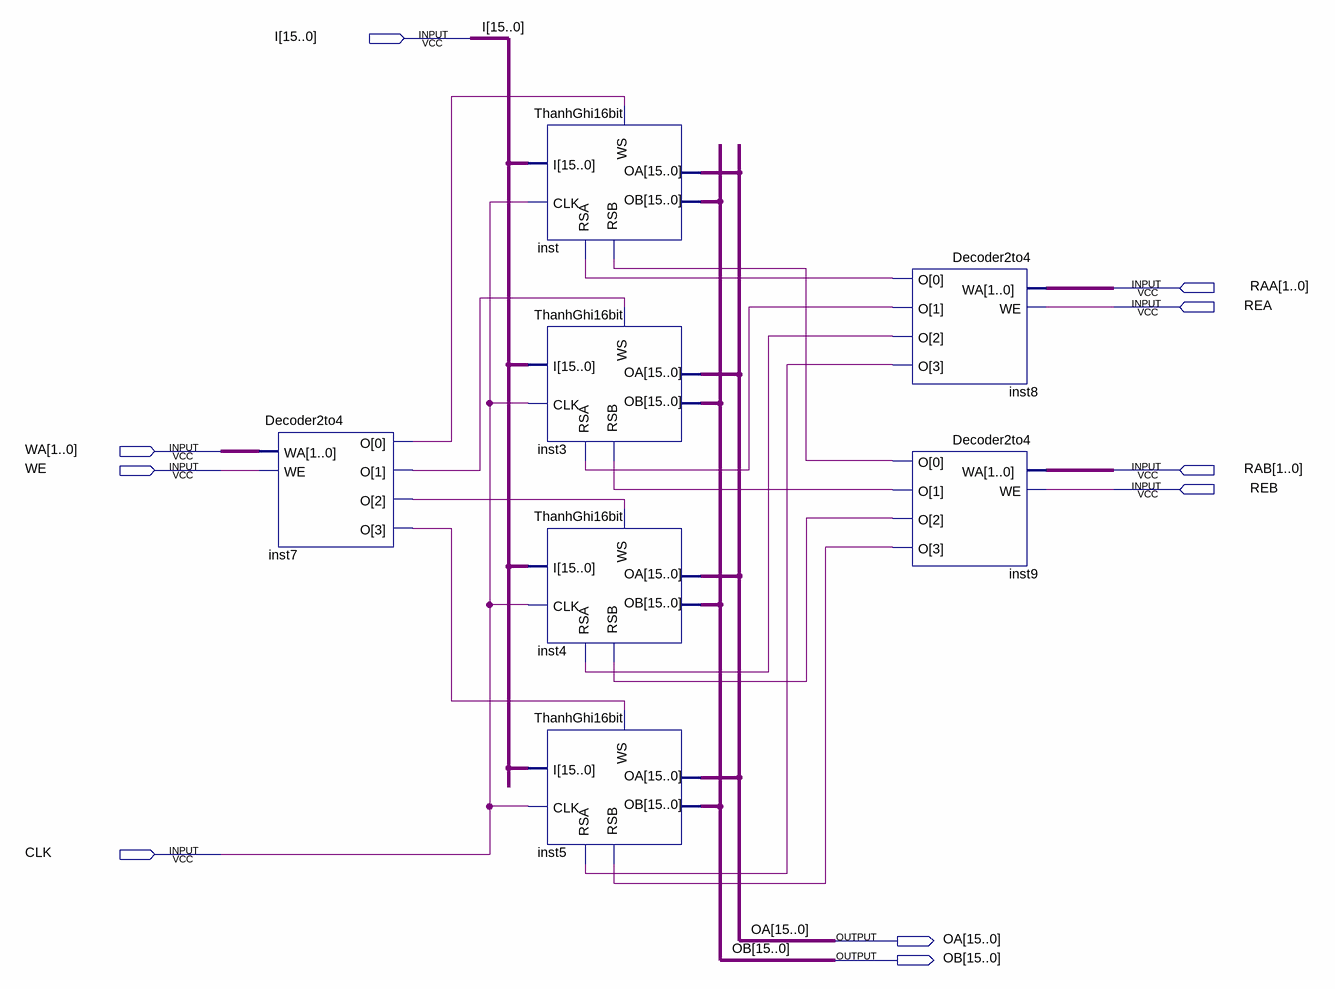
[diagram p0: schematic sheet]
// Quartus schematic RegFIle.bdf as structural Verilog: 7 symbols, 10 pins
module RegFIle (
  input  [15:0] I,
  input  [1:0] RAA,
  input  REA,
  input  [1:0] WA,
  input  WE,
  input  [1:0] RAB,
  input  REB,
  input  CLK,
  output [15:0] OA,
  output [15:0] OB
);

  wire inst7_o, inst7_o_2, inst7_o_3, inst7_o_4, inst8_o, inst8_o_2, inst8_o_3, inst8_o_4, inst9_o,
       inst9_o_2, inst9_o_3, inst9_o_4;

  Decoder2to4 inst7 (.WA(WA), .WE(WE), .O({inst7_o_4, inst7_o_3, inst7_o_2, inst7_o}));
  ThanhGhi16bit inst (.I(I), .WS(inst7_o), .RSA(inst8_o), .RSB(inst9_o), .CLK(CLK), .OA(OA), .OB(OB));
  ThanhGhi16bit inst3 (.I(I), .WS(inst7_o_2), .RSA(inst8_o_2), .RSB(inst9_o_2), .CLK(CLK), .OA(OA), .OB(OB));
  ThanhGhi16bit inst4 (.I(I), .WS(inst7_o_3), .RSA(inst8_o_3), .RSB(inst9_o_3), .CLK(CLK), .OA(OA), .OB(OB));
  ThanhGhi16bit inst5 (.I(I), .WS(inst7_o_4), .RSA(inst8_o_4), .RSB(inst9_o_4), .CLK(CLK), .OA(OA), .OB(OB));
  Decoder2to4 inst8 (.WA(RAA), .WE(REA), .O({inst8_o_4, inst8_o_3, inst8_o_2, inst8_o}));
  Decoder2to4 inst9 (.WA(RAB), .WE(REB), .O({inst9_o_4, inst9_o_3, inst9_o_2, inst9_o}));
endmodule
